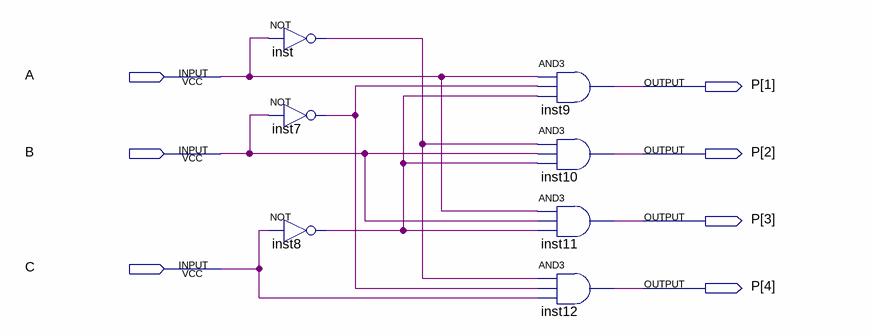
[diagram p0: schematic sheet]
// Quartus schematic decodec.bdf as structural Verilog: 7 symbols, 7 pins
module decodec (
  input  A,
  input  B,
  input  C,
  output [4:1] P
);

  wire inst7_out, inst8_out, inst_out;

  not inst (inst_out, A);
  not inst7 (inst7_out, B);
  not inst8 (inst8_out, C);
  and inst9 (P[1], A, inst7_out, inst8_out);
  and inst10 (P[2], inst_out, B, inst8_out);
  and inst11 (P[3], A, B, inst8_out);
  and inst12 (P[4], inst_out, inst7_out, C);
endmodule
